# Altium project WCE_Power_Backscatter_board.PrjPcb
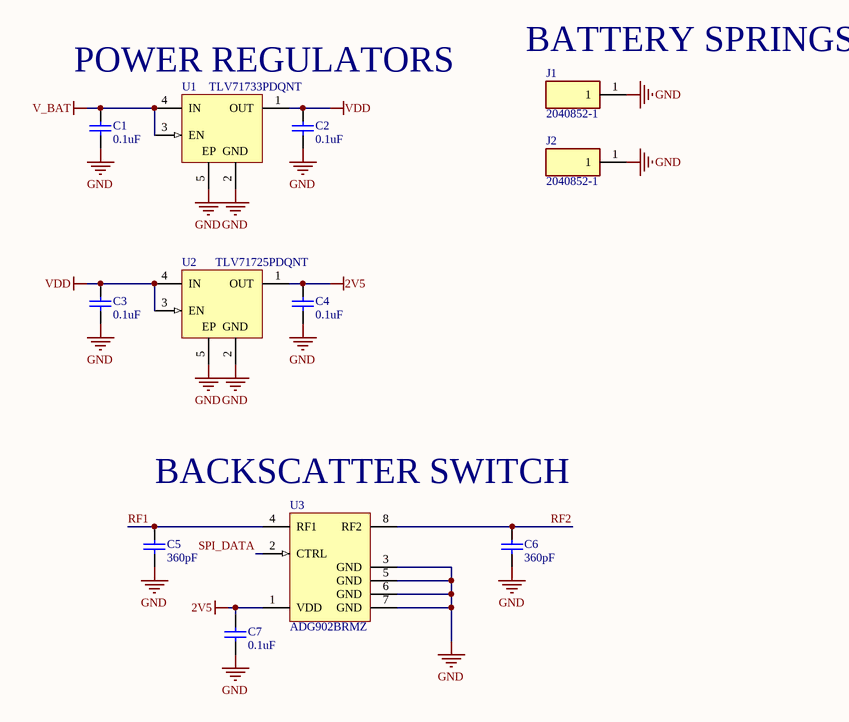
[diagram p0: WCE_Power_Backscatter.SchDoc]
1 sheet, 12 parts. Net scope: global (net labels, ports and power ports of the same name join across sheets).
Board file: WCE_Power_Backscatter.PcbDoc

## Sheet WCE_Power_Backscatter.SchDoc
size A; SheetNumber: 1; SheetTotal: 1

### Parts
C1  0.1uF  [CAPC0603X33X15LL03T05]
C2  0.1uF  [CAPC0603X33X15LL03T05]
C3  0.1uF  [CAPC0603X33X15LL03T05]
C4  0.1uF  [CAPC0603X33X15LL03T05]
C5  360pF  [CAPC0603X33X15LL03T05]
C6  360pF  [CAPC0603X33X15LL03T05]
C7  0.1uF  [CAPC0603X33X15LL03T05]
J1  2040852-1  [2040852-1]
J2  2040852-1  [2040852-1]
U1  TLV71733PDQNT  [DQN0004A_V]
U2  TLV71725PDQNT  [DQN0004A_V]
U3  ADG902BRMZ  [ADI-RM-8_L]

### Nets
2V5: C4.2 C7.2 U2.1(OUT) U3.1(VDD)
GND: C1.1 C2.1 C3.1 C4.1 C5.1 C6.1 C7.1 J1.1 J2.1 U1.2(GND) U1.5(EP) U2.2(GND) U2.5(EP) U3.3(GND) U3.5(GND) U3.6(GND) U3.7(GND)
V_BAT: C1.2 U1.3(EN) U1.4(IN)
VDD: C2.2 C3.2 U1.1(OUT) U2.3(EN) U2.4(IN)
RF1: C5.2 U3.4(RF1)
RF2: C6.2 U3.8(RF2)
SPI_DATA: U3.2(CTRL)

### Notes on the sheet
- POWER REGULATORS
- (near J1) BATTERY SPRINGS
- BACKSCATTER SWITCH

### Library data of the parts
C1-C4 C7 = CMP-2010-00159-1: Capacitor 0.1 uF 0201 XR5; Part Number: 02016D104KAT2A; Manufacturer: AVX Interconnect / Elco
C5 C6 = CMP-2010-00159-1: Capacitor 360 pF 0201 XR5; Part Number: 02016D104KAT2A; Manufacturer: AVX Interconnect / Elco
J1 J2 = 2040852-1: TE connectivity 2040852-1 PCB Spring Contact
U1 = CMP-0394-01289-2: Single Output Low Noise LDO, 150 mA, Fixed 3.3 V Output, 1.7 to 5.5 V Input, 4-pin X2SON (DQN), -40 to 85 degC, Green (RoHS & no Sb/Br); Manufacturer: Texas Instruments; SubFamily: Single Channel LDO; Iq(Typ)(mA): 0.03; Iout(Max)(A): 0.15; Vdo(Typ)(mV): 360; Accuracy(%): 1.5; Fixed Output Options(V): 3.3; Vin(Min)(V): 1.7; Vin(Max)(V): 5.5; PackageVersion: 4210367/D; PackageReference: DQN0004A; PartNumber: TLV71733PDQNT; Eco-Plan: Green (RoHS & no Sb/Br); PackageDescription: 4-Pin Plastic Small Outline, Body 1 x 1 mm, Pitch 0.65 mm; DatasheetVersion: SBVS176A; Vout Adj(Min)(V): 3.3; ComponentLink1Description: Manufacturer URL; Mounting Technology: Surface Mount; ComponentLink2Description: Datasheet; ComponentLink2URL: http://www.ti.com/general/docs/lit/getliterature.tsp?genericPartNumber=TLV71733P&fileType=pdf; Vout Adj(Max)(V): 3.3; ComponentLink1URL: http://www.ti.com/
U2 = CMP-0394-01296-2: Single Output Low Noise LDO, 150 mA, Fixed 2.5 V Output, 1.7 to 5.5 V Input, 4-pin X2SON (DQN), -40 to 85 degC, Green (RoHS & no Sb/Br); Manufacturer: Texas Instruments; Accuracy(%): 1.5; Fixed Output Options(V): 2.5; Iq(Typ)(mA): 0.03; SubFamily: Single Channel LDO; Vin(Min)(V): 1.7; Iout(Max)(A): 0.15; Vdo(Typ)(mV): 360; Vin(Max)(V): 5.5; ComponentLink1Description: Manufacturer URL; Eco-Plan: Green (RoHS & no Sb/Br); PartNumber: TLV71725PDQNT; PackageReference: DQN0004A; PackageDescription: 4-Pin Plastic Small Outline, Body 1 x 1 mm, Pitch 0.65 mm; Vout Adj(Max)(V): 2.5; ComponentLink1URL: http://www.ti.com/; Mounting Technology: Surface Mount; ComponentLink2URL: http://www.ti.com/general/docs/lit/getliterature.tsp?genericPartNumber=TLV71725P&fileType=pdf; Vout Adj(Min)(V): 2.5; ComponentLink2Description: Datasheet; DatasheetVersion: SBVS176A; PackageVersion: 4210367/D
U3 = CMP-0290-00054-1: RF Switch, Wideband, 40 dB Isolation at 1 GHz, CMOS 1.65 V to 2.75 V, SPST Switches, RM-8, Pb-Free, 50 Tube; Configuration: SPST/NO; Off Isolation: 37dB; # Sw Functions: 1; P-1dB (dBm): 17; Supply Voltage: Single (+1.65V to +2.75V); Off Isolation Test Freq: 1G; Insertion Loss (dB): 800mdB; Bandwidth: 4.5GHz; ComponentLink1URL: www.analog.com; ComponentLink2URL: http://www.analog.com/static/imported-files/data_sheets/ADG901_902.pdf; ComponentLink3URL: http://www.analog.com/static/imported-files/packages/PKG_PDF/MSOP%28RM%29/RM_8.pdf; ComponentLink1Description: Manufacturer URL; PackageVersion: Aug-2005; PackageDescription: 8-Lead Mini Small Outline Package [MSOP]; ComponentLink3Description: Package Specification; ComponentLink2Description: Datasheet; PackageReference: RM-8; DatasheetVersion: RevB; Code_JEDEC: MO-187-AA